# EAGLE design A2235-H brakeout (EAGLE 6.4)
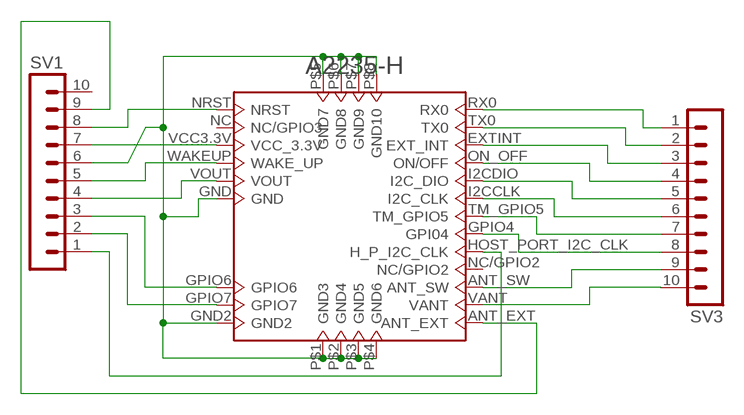
[diagram p0: schematic, sheet 1]

## Parts
SV1  MA10-1  [MA10-1]
SV3  MA10-1  [MA10-1]
U$1  A2235-H  [A2235MAESTRO]

## Nets
GND: SV1.6 U$1.GND U$1.GND2 U$1.P$1(GND3) U$1.P$2(GND4) U$1.P$3(GND5) U$1.P$4(GND6) U$1.P$5(GND7) U$1.P$6(GND8) U$1.P$7(GND9) U$1.P$8(GND10)
N$1: SV3.9 U$1.ANT_SW
N$2: SV1.8 U$1.NRST
N$3: SV3.10 U$1.VANT
N$4: SV1.5 U$1.WAKEUP(WAKE_UP)
N$5: SV1.4 U$1.VOUT
N$6: SV1.3 U$1.GPIO6
N$7: SV1.2 U$1.GPIO7
N$8: SV1.1 U$1.HOST_PORT_I2C_CLK(H_P_I2C_CLK)
N$9: SV3.1 U$1.RX0
N$10: SV3.2 U$1.TX0
N$11: SV3.3 U$1.EXTINT(EXT_INT)
N$12: SV3.4 U$1.ON_OFF(ON/OFF)
N$13: SV3.5 U$1.I2CDIO(I2C_DIO)
N$14: SV3.6 U$1.I2CCLK(I2C_CLK)
N$15: SV3.7 U$1.TM_GPIO5
N$16: SV3.8 U$1.GPIO4(GPI04)
N$17: SV1.9 U$1.ANT_EXT
VCC: SV1.7 U$1.VCC3.3V(VCC_3.3V)
Unconnected: SV1.10 U$1.NC(NC/GPIO3) U$1.NC/GPIO2

## Library data of the parts
SV1 SV3 = con-lstb:MA10-1: PIN HEADER; OC_FARNELL: unknown; OC_NEWARK: unknown
U$1 = GPS:A2235-H

## Board
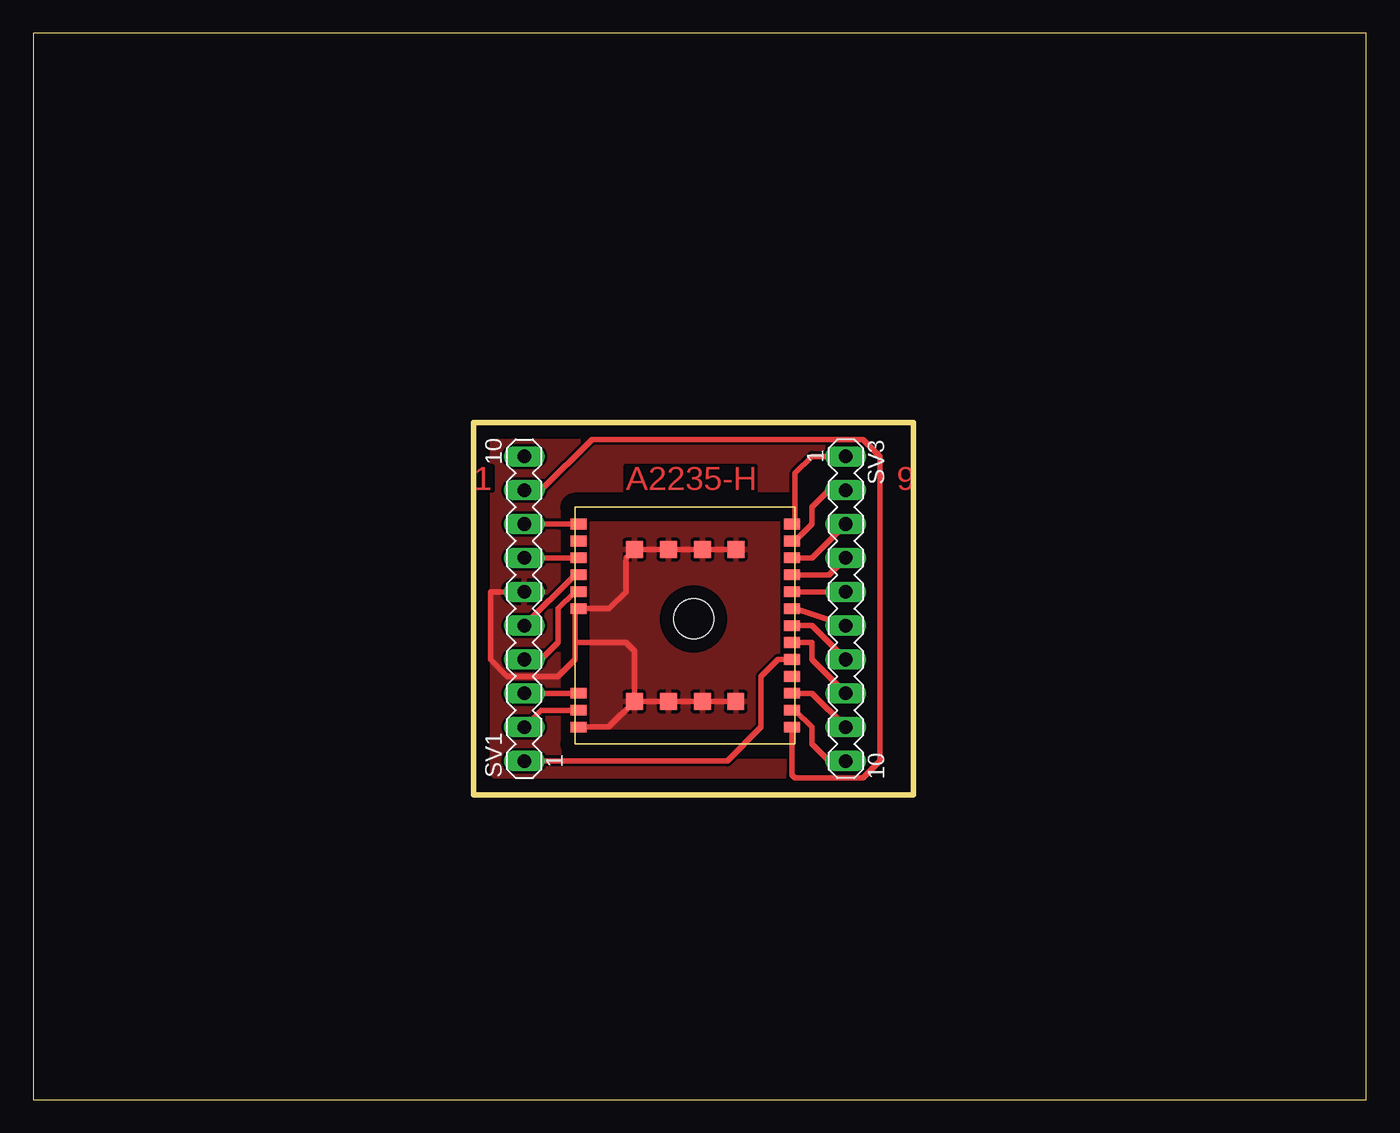
[diagram p1: board, top side]

Size 100 x 80 mm. Coordinates in mm from the lower left corner, seen from the top.
Outline: 0,0 100,0 100,80 0,80 0,0
Outline: 33.02,50.8 66.04,50.8 66.04,22.86 33.02,22.86 33.02,50.8
Copper layers (1*16): Top 0.035mm / dielectric 1.5mm / Bottom 0.035mm
Design rules "default": minimum track width 10mil, minimum drill 24mil, track to track 8mil, track to pad 8mil, pad to pad 8mil, via to via 8mil, smd to smd 8mil, copper to edge 40mil, drill to drill 8mil, minimum pad ring 10mil, minimum via ring 8mil, stop-mask expansion 4mil, vias tented up to drill 0mil, thermal gap 10mil

### Footprints (pad centres in the part's own frame; a part is rotated, then mirrored left to right if it is on the bottom)
MA10-1 = drill 1.016 long: 1 -11.43,0; 2 -8.89,0; 3 -6.35,0; 4 -3.81,0; 5 -1.27,0; 6 1.27,0; 7 3.81,0; 8 6.35,0; 9 8.89,0; 10 11.43,0
A2235MAESTRO = smd 1.2 x 0.8: ANT_EXT 16.27,1.27; ANT_SW 16.27,3.81; EXTINT 16.27,13.97; GND 0.25,10.16; GND2 0.25,1.27; GPIO4 16.27,7.62; GPIO6 0.25,3.81; GPIO7 0.25,2.54; HOST_PORT_I2C_CLK 16.27,6.35; I2CCLK 16.27,10.16; I2CDIO 16.27,11.43; NC 0.25,15.24; NC/GPIO2 16.27,5.08; NRST 0.25,16.51; ON_OFF 16.27,12.7; RX0 16.27,16.51; TM_GPIO5 16.27,8.89; TX0 16.27,15.24; VANT 16.27,2.54; VCC3.3V 0.25,13.97; VOUT 0.25,11.43; WAKEUP 0.25,12.7 | smd 1.27 x 1.27: P$1 4.45,3.2; P$2 4.45,14.6; P$3 12.06,3.2; P$4 12.08,14.6; P$5 7.01,14.6; P$6 9.55,14.6; P$7 7.03,3.2; P$8 9.56,3.2 | hole 3: 8.9,9.4

### Placement (x,y rotation side)
SV1  36.83,36.83 90 top
SV3  60.96,36.83 270 top
U$1  40.64,26.67 0 top

### Tracks (layer width: path | path; a pad name or v marks a point on that pad's centre or on a via)
GND
  Top 0.406: U$1.P$4 U$1.P$6 U$1.P$5 U$1.P$2 44.45,40.63 44.45,38.1 43.18,36.83 U$1.GND 40.64,36.83 40.64,34.29 | U$1.GND2 43.16,27.94 U$1.P$1 | U$1.P$1 U$1.P$7 U$1.P$8 U$1.P$3 | 40.64,34.29 44.45,34.29 45.09,33.65 U$1.P$1 | SV1.6 34.29,38.1 34.29,33.02 35.56,31.75 39.37,31.75 40.64,33.02 40.64,34.29
  pour Top: 64.77,22.86 35.56,22.86 33.02,26.67 33.02,46.99 34.29,50.8 64.77,50.8 66.04,46.99 66.04,25.4
N$1
  Top 0.406: U$1.ANT_SW 58.42,30.48 SV3.9
N$2
  Top 0.406: U$1.NRST 39.37,43.18 SV1.8
N$3
  Top 0.406: U$1.VANT 57.15,29.21 58.42,27.94 58.42,26.67 59.69,25.4 SV3.10
N$4
  Top 0.406: U$1.WAKEUP 40.64,39.37 SV1.5
N$5
  Top 0.406: SV1.4 38.1,33.02 39.37,34.29 39.37,36.83 40.64,38.1 U$1.VOUT
N$6
  Top 0.406: U$1.GPIO6 SV1.3
N$7
  Top 0.406: U$1.GPIO7 38.1,29.21 SV1.2
N$8
  Top 0.406: U$1.HOST_PORT_I2C_CLK 55.88,33.02 54.61,31.75 54.61,27.94 52.07,25.4 SV1.1
N$9
  Top 0.406: U$1.RX0 57.15,43.18 57.15,46.99 58.42,48.26 SV3.1
N$10
  Top 0.406: U$1.TX0 57.15,41.91 58.42,43.18 58.42,44.45 59.69,45.72 SV3.2
N$11
  Top 0.406: U$1.EXTINT 58.42,40.64 SV3.3
N$12
  Top 0.406: U$1.ON_OFF 59.69,39.37 SV3.4
N$13
  Top 0.406: SV3.5 58.42,38.1 U$1.I2CDIO
N$14
  Top 0.406: U$1.I2CCLK 57.15,36.83 SV3.6
N$15
  Top 0.406: U$1.TM_GPIO5 58.42,35.56 SV3.7
N$16
  Top 0.406: 57.15,34.29 U$1.GPIO4 58.42,34.29 58.42,33.02 SV3.8
N$17
  Top 0.406: U$1.ANT_EXT 56.91,24.37 57.15,24.13 62.23,24.13 63.5,25.4 63.5,48.26 62.23,49.53 41.91,49.53 38.1,45.72 SV1.9
VCC
  Top 0.406: U$1.VCC3.3V 39.37,40.64 SV1.7

### Text on the board
Top: 1 | A2235-H | 9